# Altium schematic sheet Processor.SchDoc
size B; Organization: Altium Limited; Address1: L3, 12a Rodborough Rd; Address2: Frenchs Forest; Address3: NSW; Address4: Australia 2086; DocumentNumber: 3; SheetNumber: 3; SheetTotal: 3
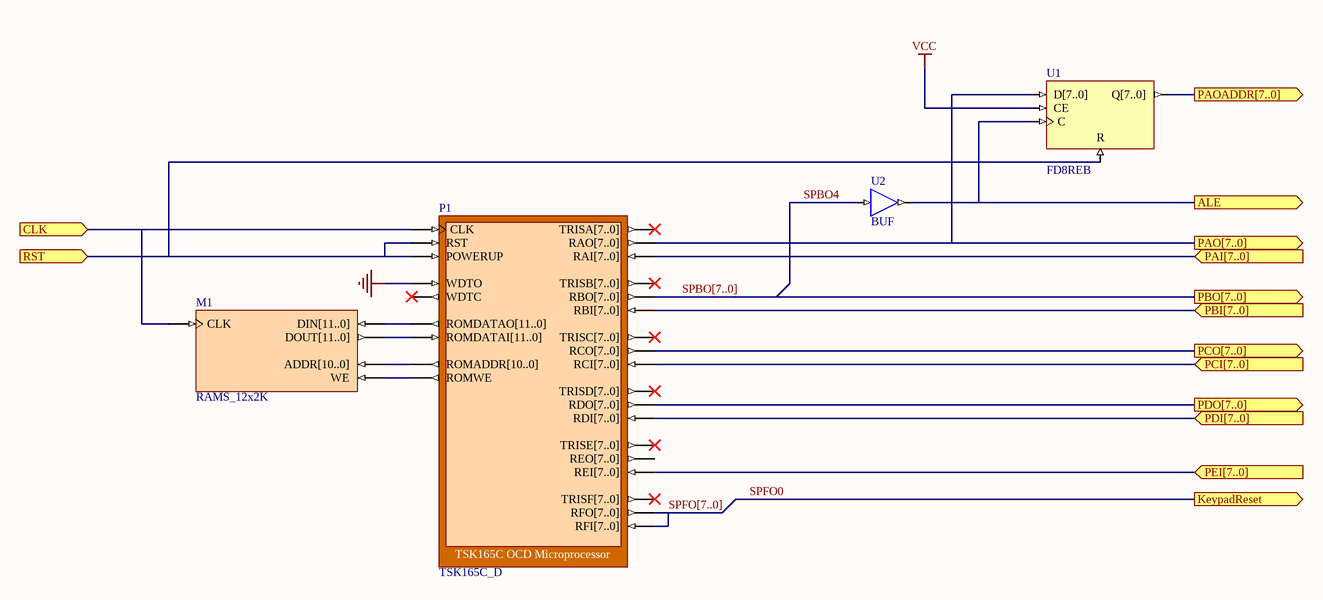
[diagram p0: Processor.SchDoc]

## Parts
M1  RAMS_12x2K
P1  TSK165C_D
U1  FD8REB
U2  BUF

## Ports
ALE (out), CLK (in), KeypadReset (out), PAI[7..0] (in), PAO[7..0] (out), PAOADDR[7..0] (out), PBI[7..0] (in), PBO[7..0] (out), PCI[7..0] (in), PCO[7..0] (out), PDI[7..0] (in), PDO[7..0] (out), PEI[7..0] (in), RST (in)

## Nets
GND: P1.WDTO
VCC: U1.CE
ALE: U1.C U2.O ; port ALE
CLK: M1.CLK P1.CLK ; port CLK
PAI[7..0]: P1.RAI[7..0] ; port PAI[7..0]
PAO[7..0]: P1.RAO[7..0] U1.D[7..0] ; port PAO[7..0]
PAOADDR[7..0]: U1.Q[7..0] ; port PAOADDR[7..0]
PBI[7..0]: P1.RBI[7..0] ; port PBI[7..0]
PCI[7..0]: P1.RCI[7..0] ; port PCI[7..0]
PCO[7..0]: P1.RCO[7..0] ; port PCO[7..0]
PDI[7..0]: P1.RDI[7..0] ; port PDI[7..0]
PDO[7..0]: P1.RDO[7..0] ; port PDO[7..0]
PEI[7..0]: P1.REI[7..0] ; port PEI[7..0]
RST: P1.POWERUP P1.RST U1.R ; port RST
SPBO4: U2.I
SPBO[7..0]: P1.RBO[7..0] ; port PBO[7..0]
SPFO0: port KeypadReset
SPFO[7..0]: P1.RFI[7..0] P1.RFO[7..0]
NetM1_ADDR[10..0]: M1.ADDR[10..0] P1.ROMADDR[10..0]
NetM1_DIN[11..0]: M1.DIN[11..0] P1.ROMDATAO[11..0]
NetM1_DOUT[11..0]: M1.DOUT[11..0] P1.ROMDATAI[11..0]
NetM1_WE: M1.WE P1.ROMWE

Not connected (* = marked no-connect by the designer): P1 REO[7..0] TRISA[7..0]* TRISB[7..0]* TRISC[7..0]* TRISD[7..0]* TRISE[7..0]* TRISF[7..0]* WDTC*

## Buses and harness runs
bus SPBO[7..0] = port PBO[7..0]
bus SPFO[7..0]

## Notes on the sheet
- Title
- Size:
- Date:
- B
- Number:
- Time:
- Revision:
- Sheet
- of
- File:

## Library data of the parts
M1 = RAMS_12x2K: Single Port Random Access Memory; Memory_Depth: 2048; Memory_Type: RAM_SinglePortBlock; Memory_Width: 12; Memory_ClockEdge: Rising; Nexus_Core: Memory_Program; Published: 13/01/2004; Publisher: Altium Hobart Technology Center
P1 = TSK165C_D: TSK165C OCD Microprocessor; NEXUS_CORE: Processor_OCDS; NEXUS_JTAG_DEVICE: True; NEXUS_JTAG_ORDER: 0; ChildModel1: TSK165C_D_RAM128x8; ChildCore1: M1; Memory_Configuration: Record[NEXUS_CORE]{}ComponentDesignator[xram]{}Memory_Depth[128]{}Memory_UsageType[ram]{}ProgramDownloadAddress[0x0]{}Memory_BusType[c165x:data_bus]{n}Record[NEXUS_CORE]{}ComponentDesignator[xrom]{}Memory_Depth[2k]{}Memory_UsageType[rom]{}ProgramDownloadAddress[0x0]{}Memory_BusType[c165x:code_bus]{}Memory_Mau[12]{n}; Published: 18/12/2003; Publisher: Altium Hobart Technology Centre; Core Revision: 1.00.00
U1 = FD8REB: 8-Bit D-Type Flip-Flop with Clock Enable and Synchronous Reset, Bus Version; Xilinx Equivalent: FD8RE; ArchiveName: GENERIC; Published: 18-Dec-2003; Publisher: Altium Limited; Core Revision: 1.00.00
U2 = BUF: 1-bit General Purpose (Non-inverting) Buffer; ArchiveName: GENERIC; Published: 18-Dec-2003; Publisher: Altium Limited; Xilinx Equivalent: BUF; Core Revision: 1.00.00